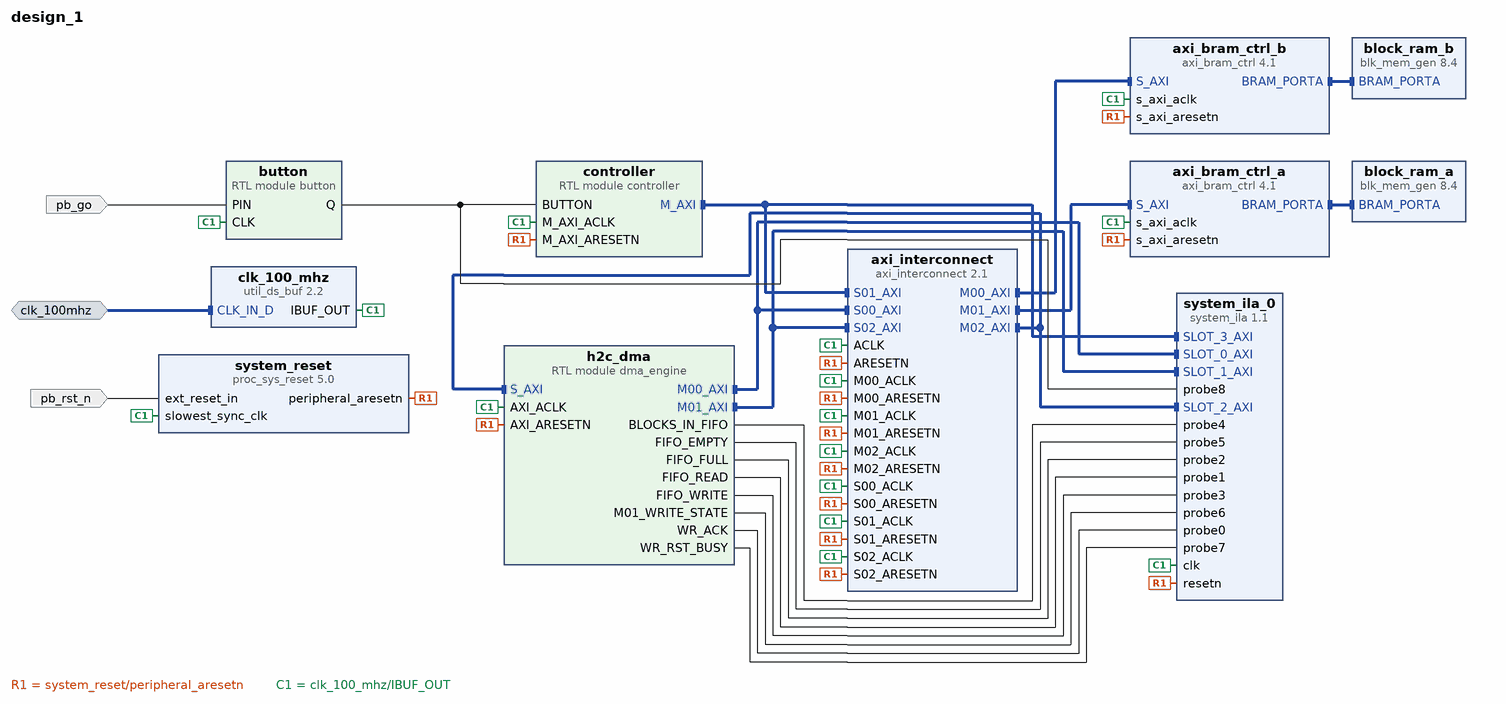
[diagram p0: block diagram of the top level]
# Vivado block design design_1, xczu19eg-ffvc1760-2-i, Vivado 2021.1
create_bd_design design_1

create_bd_intf_port -mode Slave -vlnv xilinx.com:interface:diff_clock_rtl:1.0 clk_100mhz
create_bd_port -dir I -type rst pb_rst_n
create_bd_port -dir I pb_go

create_bd_cell -type ip -vlnv xilinx.com:ip:axi_bram_ctrl:4.1 axi_bram_ctrl_a
set_property -dict {CONFIG.DATA_WIDTH 512 CONFIG.READ_LATENCY 1 CONFIG.SINGLE_PORT_BRAM 1} [get_bd_cells axi_bram_ctrl_a]
create_bd_cell -type ip -vlnv xilinx.com:ip:axi_bram_ctrl:4.1 axi_bram_ctrl_b
set_property -dict {CONFIG.DATA_WIDTH 512 CONFIG.READ_LATENCY 1 CONFIG.SINGLE_PORT_BRAM 1} [get_bd_cells axi_bram_ctrl_b]
create_bd_cell -type ip -vlnv xilinx.com:ip:blk_mem_gen:8.4 block_ram_b
set_property -dict {CONFIG.EN_SAFETY_CKT false} [get_bd_cells block_ram_b]
create_bd_cell -type ip -vlnv xilinx.com:ip:axi_interconnect:2.1 axi_interconnect
set_property -dict {CONFIG.NUM_MI 3 CONFIG.NUM_SI 3} [get_bd_cells axi_interconnect]
create_bd_cell -type ip -vlnv xilinx.com:ip:blk_mem_gen:8.4 block_ram_a
set_property -dict [list \
  CONFIG.EN_SAFETY_CKT false \
  CONFIG.Memory_Type Single_Port_RAM \
  CONFIG.Port_B_Clock 0 \
  CONFIG.Port_B_Enable_Rate 0 \
  CONFIG.Port_B_Write_Rate 0 \
] [get_bd_cells block_ram_a]
create_bd_cell -type module -reference button button
set_property -dict {CONFIG.ACTIVE_STATE 0 CONFIG.CLOCKS_PER_USEC 100} [get_bd_cells button]
create_bd_cell -type ip -vlnv xilinx.com:ip:proc_sys_reset:5.0 system_reset
create_bd_cell -type ip -vlnv xilinx.com:ip:util_ds_buf:2.2 clk_100_mhz
create_bd_cell -type ip -vlnv xilinx.com:ip:system_ila:1.1 system_ila_0
set_property -dict [list \
  CONFIG.C_MON_TYPE MIX \
  CONFIG.C_NUM_MONITOR_SLOTS 4 \
  CONFIG.C_NUM_OF_PROBES 9 \
  CONFIG.C_PROBE0_TYPE 0 \
  CONFIG.C_PROBE1_TYPE 0 \
  CONFIG.C_PROBE2_TYPE 0 \
  CONFIG.C_PROBE3_TYPE 0 \
  CONFIG.C_PROBE4_TYPE 0 \
  CONFIG.C_PROBE5_TYPE 0 \
  CONFIG.C_PROBE6_TYPE 0 \
  CONFIG.C_PROBE7_TYPE 0 \
  CONFIG.C_PROBE8_TYPE 0 \
  CONFIG.C_SLOT_0_APC_EN 0 \
  CONFIG.C_SLOT_0_AXI_AR_SEL_DATA 1 \
  CONFIG.C_SLOT_0_AXI_AR_SEL_TRIG 1 \
  CONFIG.C_SLOT_0_AXI_AW_SEL_DATA 1 \
  CONFIG.C_SLOT_0_AXI_AW_SEL_TRIG 1 \
  CONFIG.C_SLOT_0_AXI_B_SEL_DATA 1 \
  CONFIG.C_SLOT_0_AXI_B_SEL_TRIG 1 \
  CONFIG.C_SLOT_0_AXI_R_SEL_DATA 1 \
  CONFIG.C_SLOT_0_AXI_R_SEL_TRIG 1 \
  CONFIG.C_SLOT_0_AXI_W_SEL_DATA 1 \
  CONFIG.C_SLOT_0_AXI_W_SEL_TRIG 1 \
  CONFIG.C_SLOT_0_INTF_TYPE xilinx.com:interface:aximm_rtl:1.0 \
  CONFIG.C_SLOT_1_APC_EN 0 \
  CONFIG.C_SLOT_1_AXI_AR_SEL_DATA 1 \
  CONFIG.C_SLOT_1_AXI_AR_SEL_TRIG 1 \
  CONFIG.C_SLOT_1_AXI_AW_SEL_DATA 1 \
  CONFIG.C_SLOT_1_AXI_AW_SEL_TRIG 1 \
  CONFIG.C_SLOT_1_AXI_B_SEL_DATA 1 \
  CONFIG.C_SLOT_1_AXI_B_SEL_TRIG 1 \
  CONFIG.C_SLOT_1_AXI_R_SEL_DATA 1 \
  CONFIG.C_SLOT_1_AXI_R_SEL_TRIG 1 \
  CONFIG.C_SLOT_1_AXI_W_SEL_DATA 1 \
  CONFIG.C_SLOT_1_AXI_W_SEL_TRIG 1 \
  CONFIG.C_SLOT_1_INTF_TYPE xilinx.com:interface:aximm_rtl:1.0 \
  CONFIG.C_SLOT_2_APC_EN 0 \
  CONFIG.C_SLOT_2_AXI_AR_SEL_DATA 1 \
  CONFIG.C_SLOT_2_AXI_AR_SEL_TRIG 1 \
  CONFIG.C_SLOT_2_AXI_AW_SEL_DATA 1 \
  CONFIG.C_SLOT_2_AXI_AW_SEL_TRIG 1 \
  CONFIG.C_SLOT_2_AXI_B_SEL_DATA 1 \
  CONFIG.C_SLOT_2_AXI_B_SEL_TRIG 1 \
  CONFIG.C_SLOT_2_AXI_R_SEL_DATA 1 \
  CONFIG.C_SLOT_2_AXI_R_SEL_TRIG 1 \
  CONFIG.C_SLOT_2_AXI_W_SEL_DATA 1 \
  CONFIG.C_SLOT_2_AXI_W_SEL_TRIG 1 \
  CONFIG.C_SLOT_2_INTF_TYPE xilinx.com:interface:aximm_rtl:1.0 \
  CONFIG.C_SLOT_3_APC_EN 0 \
  CONFIG.C_SLOT_3_AXI_AR_SEL_DATA 1 \
  CONFIG.C_SLOT_3_AXI_AR_SEL_TRIG 1 \
  CONFIG.C_SLOT_3_AXI_AW_SEL_DATA 1 \
  CONFIG.C_SLOT_3_AXI_AW_SEL_TRIG 1 \
  CONFIG.C_SLOT_3_AXI_B_SEL_DATA 1 \
  CONFIG.C_SLOT_3_AXI_B_SEL_TRIG 1 \
  CONFIG.C_SLOT_3_AXI_R_SEL_DATA 1 \
  CONFIG.C_SLOT_3_AXI_R_SEL_TRIG 1 \
  CONFIG.C_SLOT_3_AXI_W_SEL_DATA 1 \
  CONFIG.C_SLOT_3_AXI_W_SEL_TRIG 1 \
  CONFIG.C_SLOT_3_INTF_TYPE xilinx.com:interface:aximm_rtl:1.0 \
] [get_bd_cells system_ila_0]
create_bd_cell -type module -reference controller controller
create_bd_cell -type module -reference dma_engine h2c_dma

# ---- connections ----

connect_bd_intf_net -intf_net CLK_IN_D_0_1 [get_bd_intf_ports clk_100mhz] [get_bd_intf_pins clk_100_mhz/CLK_IN_D]
connect_bd_intf_net -intf_net axi_bram_ctrl_0_BRAM_PORTA [get_bd_intf_pins axi_bram_ctrl_a/BRAM_PORTA] [get_bd_intf_pins block_ram_a/BRAM_PORTA]
connect_bd_intf_net [get_bd_intf_pins axi_bram_ctrl_b/BRAM_PORTA] [get_bd_intf_pins block_ram_b/BRAM_PORTA]
connect_bd_intf_net -intf_net axi_interconnect_0_M00_AXI [get_bd_intf_pins axi_interconnect/M00_AXI] [get_bd_intf_pins axi_bram_ctrl_b/S_AXI]
connect_bd_intf_net -intf_net axi_interconnect_0_M01_AXI [get_bd_intf_pins axi_interconnect/M01_AXI] [get_bd_intf_pins axi_bram_ctrl_a/S_AXI]
connect_bd_intf_net -intf_net axi_interconnect_M02_AXI [get_bd_intf_pins axi_interconnect/M02_AXI] [get_bd_intf_pins h2c_dma/S_AXI]
connect_bd_intf_net [get_bd_intf_pins axi_interconnect/M02_AXI] [get_bd_intf_pins system_ila_0/SLOT_2_AXI]
connect_bd_intf_net -intf_net controller_0_M_AXI [get_bd_intf_pins controller/M_AXI] [get_bd_intf_pins axi_interconnect/S01_AXI]
connect_bd_intf_net [get_bd_intf_pins controller/M_AXI] [get_bd_intf_pins system_ila_0/SLOT_3_AXI]
connect_bd_intf_net -intf_net h2c_dma_PCI_AXI [get_bd_intf_pins h2c_dma/M00_AXI] [get_bd_intf_pins axi_interconnect/S00_AXI]
connect_bd_intf_net [get_bd_intf_pins h2c_dma/M00_AXI] [get_bd_intf_pins system_ila_0/SLOT_0_AXI]
connect_bd_intf_net -intf_net h2f_dma_M01_AXI [get_bd_intf_pins h2c_dma/M01_AXI] [get_bd_intf_pins axi_interconnect/S02_AXI]
connect_bd_intf_net [get_bd_intf_pins h2c_dma/M01_AXI] [get_bd_intf_pins system_ila_0/SLOT_1_AXI]
connect_bd_net -net BLOCKS_IN_FIFO [get_bd_pins h2c_dma/BLOCKS_IN_FIFO] [get_bd_pins system_ila_0/probe4]
connect_bd_net -net FIFO_EMPTY [get_bd_pins h2c_dma/FIFO_EMPTY] [get_bd_pins system_ila_0/probe5]
connect_bd_net -net FIFO_FULL [get_bd_pins h2c_dma/FIFO_FULL] [get_bd_pins system_ila_0/probe2]
connect_bd_net -net FIFO_READ [get_bd_pins h2c_dma/FIFO_READ] [get_bd_pins system_ila_0/probe1]
connect_bd_net -net FIFO_WRITE [get_bd_pins h2c_dma/FIFO_WRITE] [get_bd_pins system_ila_0/probe3]
connect_bd_net -net M01_WRITE_STATE [get_bd_pins h2c_dma/M01_WRITE_STATE] [get_bd_pins system_ila_0/probe6]
connect_bd_net -net PIN_0_1 [get_bd_ports pb_go] [get_bd_pins button/PIN]
connect_bd_net -net WR_ACK [get_bd_pins h2c_dma/WR_ACK] [get_bd_pins system_ila_0/probe0]
connect_bd_net -net WR_RST_BUSY [get_bd_pins h2c_dma/WR_RST_BUSY] [get_bd_pins system_ila_0/probe7]
connect_bd_net -net button_Q [get_bd_pins button/Q] [get_bd_pins system_ila_0/probe8] [get_bd_pins controller/BUTTON]
connect_bd_net -net ext_reset_in_0_1 [get_bd_ports pb_rst_n] [get_bd_pins system_reset/ext_reset_in]
connect_bd_net -net proc_sys_reset_0_peripheral_aresetn [get_bd_pins system_reset/peripheral_aresetn] \
  [get_bd_pins axi_bram_ctrl_a/s_axi_aresetn] [get_bd_pins axi_bram_ctrl_b/s_axi_aresetn] \
  [get_bd_pins axi_interconnect/ARESETN] [get_bd_pins axi_interconnect/S00_ARESETN] \
  [get_bd_pins axi_interconnect/M00_ARESETN] [get_bd_pins axi_interconnect/M01_ARESETN] \
  [get_bd_pins axi_interconnect/M02_ARESETN] [get_bd_pins axi_interconnect/S01_ARESETN] \
  [get_bd_pins axi_interconnect/S02_ARESETN] [get_bd_pins system_ila_0/resetn] [get_bd_pins controller/M_AXI_ARESETN] \
  [get_bd_pins h2c_dma/AXI_ARESETN]
connect_bd_net -net system_clock_clk_100mhz [get_bd_pins clk_100_mhz/IBUF_OUT] \
  [get_bd_pins axi_bram_ctrl_a/s_axi_aclk] [get_bd_pins axi_bram_ctrl_b/s_axi_aclk] [get_bd_pins axi_interconnect/ACLK] \
  [get_bd_pins axi_interconnect/S00_ACLK] [get_bd_pins axi_interconnect/M00_ACLK] [get_bd_pins axi_interconnect/M01_ACLK] \
  [get_bd_pins button/CLK] [get_bd_pins system_reset/slowest_sync_clk] [get_bd_pins axi_interconnect/M02_ACLK] \
  [get_bd_pins axi_interconnect/S01_ACLK] [get_bd_pins axi_interconnect/S02_ACLK] [get_bd_pins system_ila_0/clk] \
  [get_bd_pins controller/M_AXI_ACLK] [get_bd_pins h2c_dma/AXI_ACLK]
set_property HDL_ATTRIBUTE.DEBUG true [get_bd_intf_nets axi_interconnect_M02_AXI]
set_property HDL_ATTRIBUTE.MARK_DEBUG true [get_bd_intf_nets axi_interconnect_M02_AXI]
set_property HDL_ATTRIBUTE.DEBUG true [get_bd_intf_nets controller_0_M_AXI]
set_property HDL_ATTRIBUTE.MARK_DEBUG true [get_bd_intf_nets controller_0_M_AXI]
set_property HDL_ATTRIBUTE.DEBUG true [get_bd_intf_nets h2c_dma_PCI_AXI]
set_property HDL_ATTRIBUTE.MARK_DEBUG true [get_bd_intf_nets h2c_dma_PCI_AXI]
set_property HDL_ATTRIBUTE.DEBUG true [get_bd_intf_nets h2f_dma_M01_AXI]
set_property HDL_ATTRIBUTE.MARK_DEBUG true [get_bd_intf_nets h2f_dma_M01_AXI]
set_property HDL_ATTRIBUTE.DEBUG true [get_bd_nets BLOCKS_IN_FIFO]
set_property HDL_ATTRIBUTE.MARK_DEBUG true [get_bd_nets BLOCKS_IN_FIFO]
set_property HDL_ATTRIBUTE.DEBUG true [get_bd_nets FIFO_EMPTY]
set_property HDL_ATTRIBUTE.MARK_DEBUG true [get_bd_nets FIFO_EMPTY]
set_property HDL_ATTRIBUTE.DEBUG true [get_bd_nets FIFO_FULL]
set_property HDL_ATTRIBUTE.MARK_DEBUG true [get_bd_nets FIFO_FULL]
set_property HDL_ATTRIBUTE.DEBUG true [get_bd_nets FIFO_READ]
set_property HDL_ATTRIBUTE.MARK_DEBUG true [get_bd_nets FIFO_READ]
set_property HDL_ATTRIBUTE.DEBUG true [get_bd_nets FIFO_WRITE]
set_property HDL_ATTRIBUTE.MARK_DEBUG true [get_bd_nets FIFO_WRITE]
set_property HDL_ATTRIBUTE.DEBUG true [get_bd_nets M01_WRITE_STATE]
set_property HDL_ATTRIBUTE.MARK_DEBUG true [get_bd_nets M01_WRITE_STATE]
set_property HDL_ATTRIBUTE.DEBUG true [get_bd_nets WR_ACK]
set_property HDL_ATTRIBUTE.MARK_DEBUG true [get_bd_nets WR_ACK]
set_property HDL_ATTRIBUTE.DEBUG true [get_bd_nets WR_RST_BUSY]
set_property HDL_ATTRIBUTE.MARK_DEBUG true [get_bd_nets WR_RST_BUSY]
set_property HDL_ATTRIBUTE.DEBUG true [get_bd_nets button_Q]
set_property HDL_ATTRIBUTE.MARK_DEBUG true [get_bd_nets button_Q]

# ---- address map ----
assign_bd_address -offset 0x00001000 -range 4K -target_address_space [get_bd_addr_spaces controller/M_AXI] [get_bd_addr_segs h2c_dma/S_AXI/reg0]
assign_bd_address -offset 0xC0000000 -range 32K -target_address_space [get_bd_addr_spaces controller/M_AXI] [get_bd_addr_segs axi_bram_ctrl_a/S_AXI/Mem0]
assign_bd_address -offset 0xC2000000 -range 32K -target_address_space [get_bd_addr_spaces controller/M_AXI] [get_bd_addr_segs axi_bram_ctrl_b/S_AXI/Mem0]
assign_bd_address -offset 0x0000000000001000 -range 4K -target_address_space [get_bd_addr_spaces h2c_dma/M00_AXI] [get_bd_addr_segs h2c_dma/S_AXI/reg0]
assign_bd_address -offset 0x00000000C0000000 -range 32K -target_address_space [get_bd_addr_spaces h2c_dma/M00_AXI] [get_bd_addr_segs axi_bram_ctrl_a/S_AXI/Mem0]
assign_bd_address -offset 0x00000000C2000000 -range 32K -target_address_space [get_bd_addr_spaces h2c_dma/M00_AXI] [get_bd_addr_segs axi_bram_ctrl_b/S_AXI/Mem0]
assign_bd_address -offset 0x0000000000001000 -range 4K -target_address_space [get_bd_addr_spaces h2c_dma/M01_AXI] [get_bd_addr_segs h2c_dma/S_AXI/reg0]
assign_bd_address -offset 0x00000000C0000000 -range 32K -target_address_space [get_bd_addr_spaces h2c_dma/M01_AXI] [get_bd_addr_segs axi_bram_ctrl_a/S_AXI/Mem0]
assign_bd_address -offset 0x00000000C2000000 -range 32K -target_address_space [get_bd_addr_spaces h2c_dma/M01_AXI] [get_bd_addr_segs axi_bram_ctrl_b/S_AXI/Mem0]

validate_bd_design
save_bd_design
